# EAGLE design placa (EAGLE 7.6.0)
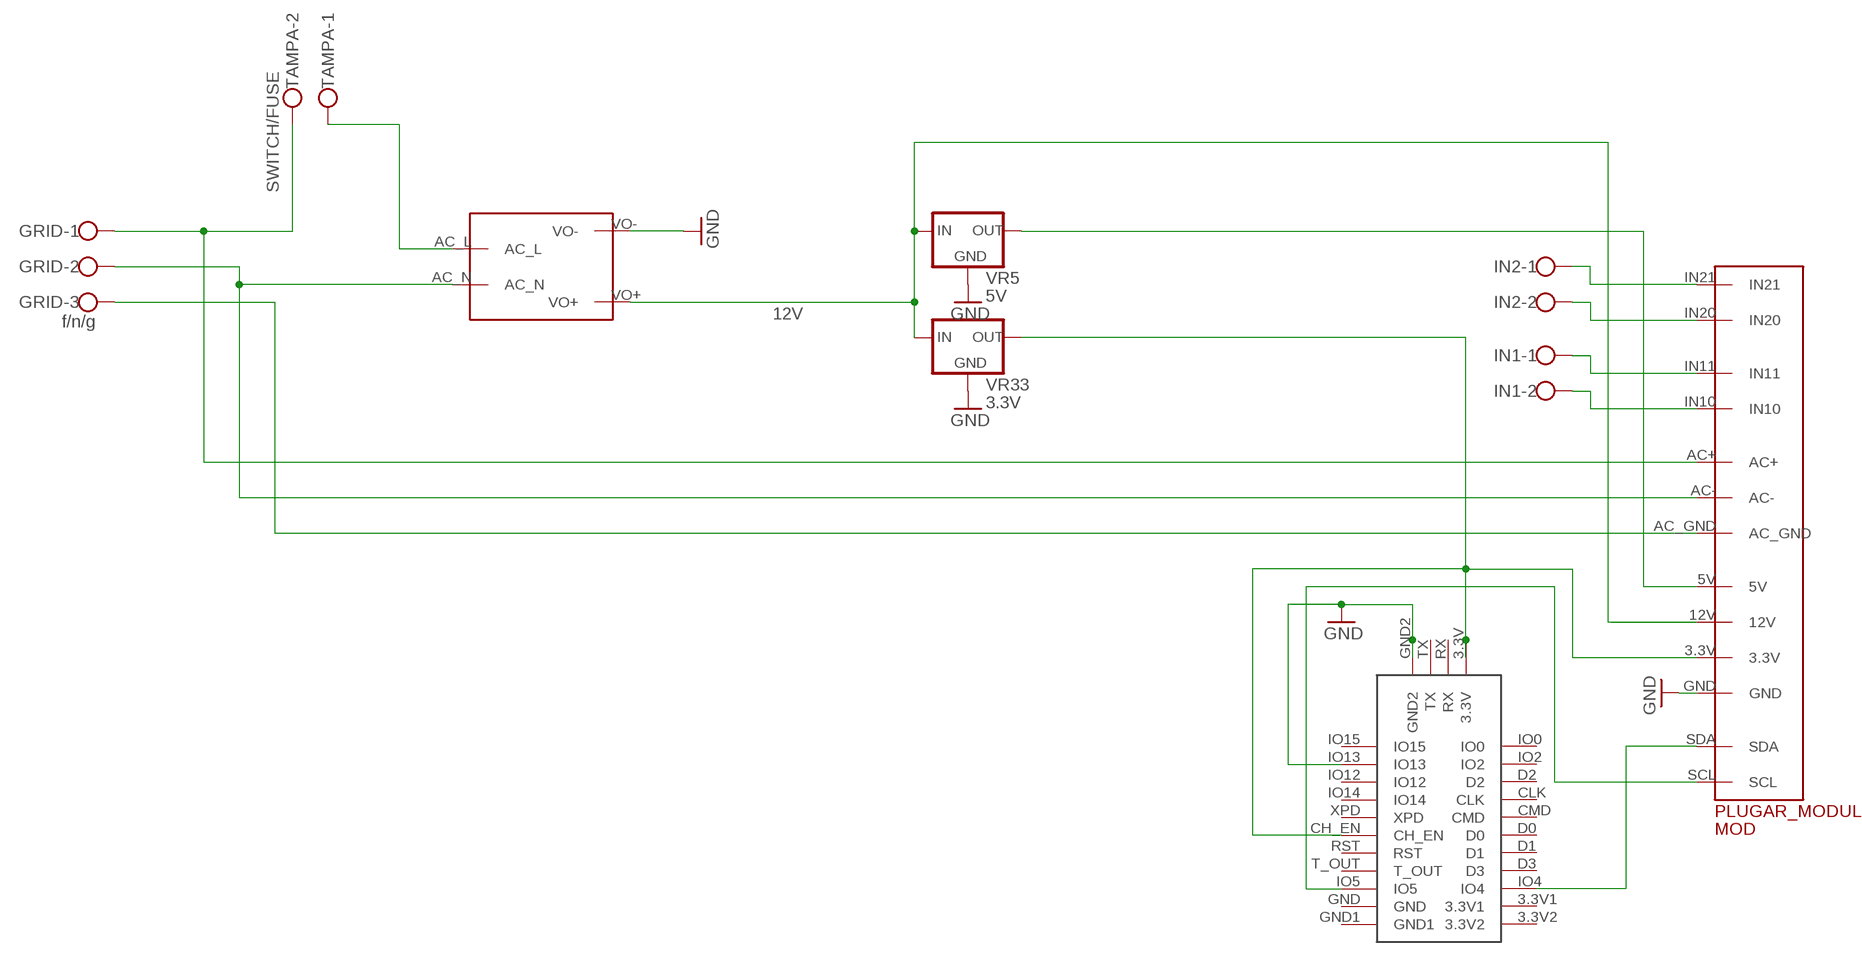
[diagram p0: schematic, sheet 1]

## Parts
GRID  f/n/g  W237-103  [W237-103]
IN1  W237-102  [W237-102]
IN2  W237-102  [W237-102]
MOD  PLUGARPADS  [PLUGAR]
TAMPA  SWITCH/FUSE  W237-102  [W237-102]
U$1  MAINS_CONVERTERS  [HLK-PM01]
U$2  ESP-201  [ESP-201]
VR5  5V  78LXX  [78LXX]
VR33  3.3V  78LXX  [78LXX]

## Nets
3.3V: MOD.3.3V U$2.3.3V U$2.CH_EN VR33.OUT
5V: MOD.5V VR5.OUT
12V: MOD.12V U$1.VO+ VR5.IN VR33.IN
AC+: GRID.1 MOD.AC+ TAMPA.2
AC-: GRID.2 MOD.AC- U$1.AC_N
AC_GND: GRID.3 MOD.AC_GND
GND: MOD.GND U$1.VO- U$2.GND2 U$2.IO13 VR5.GND VR33.GND
N$1: IN2.1 MOD.IN21
N$2: TAMPA.1 U$1.AC_L
N$3: IN2.2 MOD.IN20
N$4: IN1.1 MOD.IN11
N$5: IN1.2 MOD.IN10
SCL: MOD.SCL U$2.IO5
SDA: MOD.SDA U$2.IO4
Unconnected: U$2.3.3V1 U$2.3.3V2 U$2.CLK U$2.CMD U$2.D0 U$2.D1 U$2.D2 U$2.D3 U$2.GND U$2.GND1 U$2.IO0 U$2.IO2 U$2.IO12 U$2.IO14 U$2.IO15 U$2.RST U$2.RX U$2.T_OUT U$2.TX U$2.XPD

## Library data of the parts
GRID = con-wago-500:W237-103: WAGO SCREW CLAMP; MPN: 237-103; OC_FARNELL: unknown; OC_NEWARK: 18M7116
IN1 IN2 TAMPA = con-wago-500:W237-102: WAGO SCREW CLAMP; MPN: 237-102; OC_FARNELL: unknown; OC_NEWARK: 70K9898
MOD = PLUGAR_pads:PLUGARPADS
U$1 = captain-slow:MAINS_CONVERTERS
U$2 = PLUGAR_pads:ESP-201
VR5 VR33 = v-reg:78LXX: VOLTAGE REGULATOR

## Net classes
0 default: width 0.305 mm, drill 0.508 mm, clearance 0.203 mm

## Board
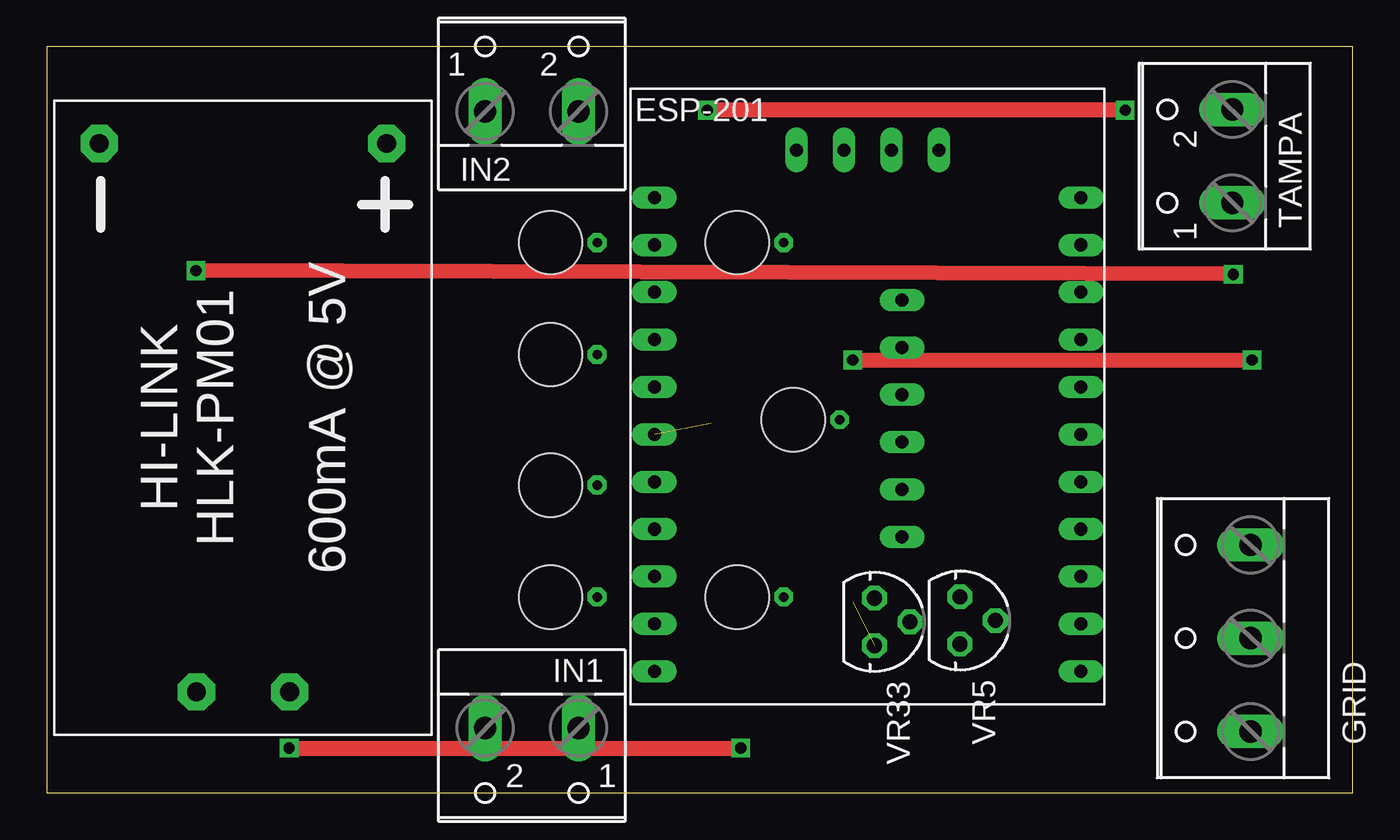
[diagram p1: board, top side]
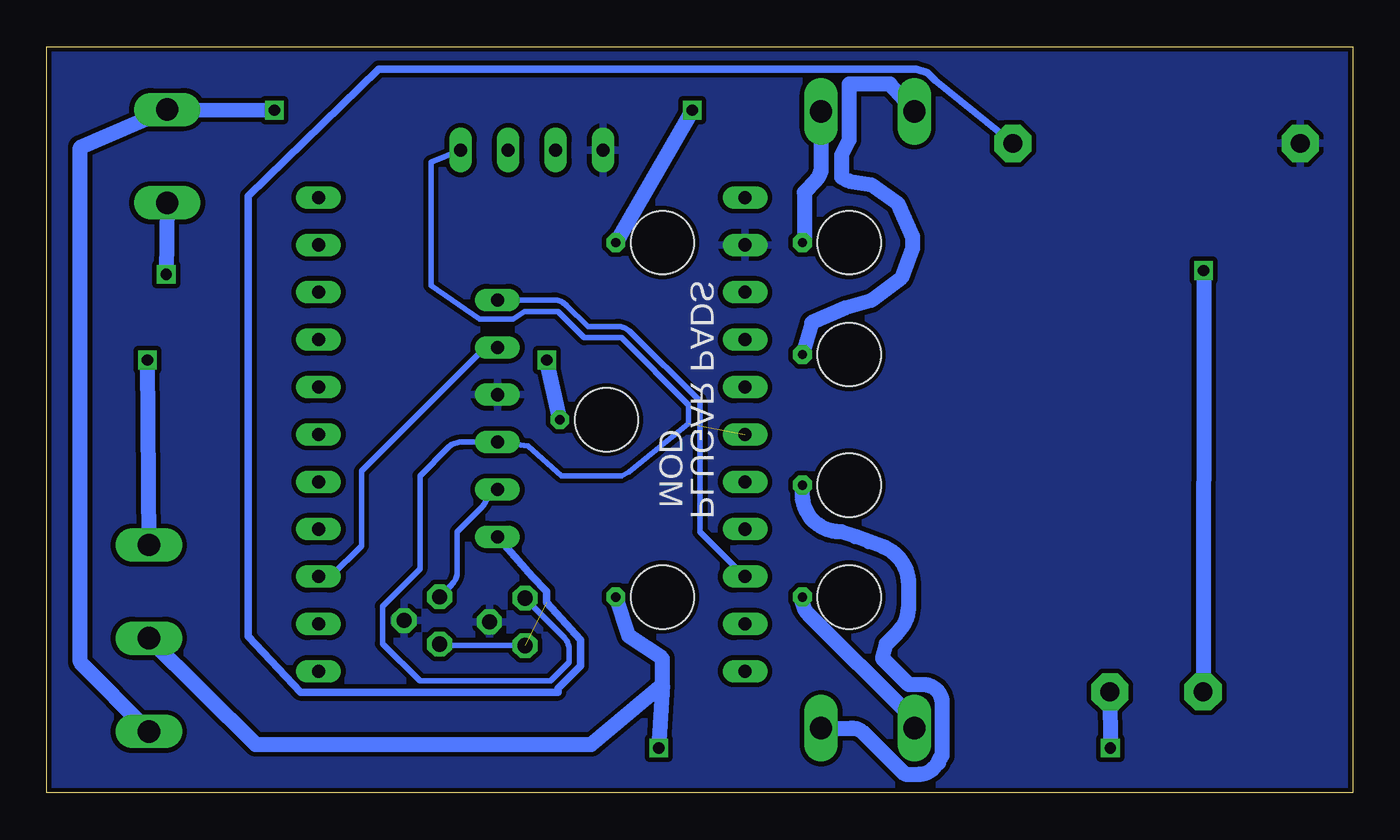
[diagram p2: board, bottom side, seen from below]

Size 70 x 40 mm. Coordinates in mm from the lower left corner, seen from the top.
Outline: 70,0 70,40 0,40 0,0 70,0
Copper layers (1*16): Top 0.035mm / dielectric 1.5mm / Bottom 0.035mm
Design rules "default *": minimum track width 10mil, minimum drill 0.1mm, track to track 0.25mm, track to pad 0.25mm, pad to pad 0.25mm, via to via 0.25mm, smd to smd 0.25mm, copper to edge 0.25mm, drill to drill 0.25mm, minimum pad ring 10mil, minimum via ring 8mil, stop-mask expansion 4mil, vias tented up to drill 0mil, thermal gap 10mil

### Footprints (pad centres in the part's own frame; a part is rotated, then mirrored left to right if it is on the bottom)
W237-103 = drill 1.194 long: 1 -5,-1.29; 2 0,-1.29; 3 5,-1.29
W237-102 = drill 1.194 long: 1 -2.5,-1.27; 2 2.5,-1.27
PLUGAR = drill 0.7 long: 3.3V -1.2,-5.84; 5V -3.74,-5.84; 12V -6.28,-5.84; GND 1.34,-5.84; SCL 6.42,-5.84; SDA 3.88,-5.84 | drill 0.5 pad 0.61 octagon: AC+ 9.5,0.5; AC- -9.5,0.5; AC_GND 0,-2.5; IN10 -9.5,10.5; IN11 -3.5,10.5; IN20 9.5,10.5; IN21 3.5,10.5 | hole 3.4: 0,0; 9.5,3; -9.5,3; -9.5,13; 9.5,13; -3.5,13; 3.5,13
HLK-PM01 = drill 1 pad 2 octagon: AC_L -14.7,2.5; AC_N -14.7,-2.5; VO+ 14.7,-7.7; VO- 14.7,7.7
ESP-201 = drill 0.7 pad 0.813 long: 3.3V 3.81,12.7; 3.3V1 11.43,-12.7; 3.3V2 11.43,-15.24; CH_EN -11.43,-2.54; CLK 11.43,2.54; CMD 11.43,0; D0 11.43,-2.54; D1 11.43,-5.08; D2 11.43,5.08; D3 11.43,-7.62; GND -11.43,-12.7; GND1 -11.43,-15.24; GND2 -3.81,12.7; IO0 11.43,10.16; IO2 11.43,7.62; IO4 11.43,-10.16; IO5 -11.43,-10.16; IO12 -11.43,5.08; IO13 -11.43,7.62; IO14 -11.43,2.54; IO15 -11.43,10.16; RST -11.43,-5.08; RX 1.27,12.7; T_OUT -11.43,-7.62; TX -1.27,12.7; XPD -11.43,0
78LXX = drill 0.813 octagon: GND 0,1.905; IN 1.27,0; OUT -1.27,0

### Placement (x,y rotation side)
GRID  63.23,8.29 90 top
IN1  26,2.2 180 top
IN2  26,37.8 0 top
MOD  40,20 90 top
TAMPA  62.27,34.13 90 top
U$1  10.52,20.11 90 top
U$2  44,21.75 0 top
VR5  48.94,9.24 270 top
VR33  44.36,9.17 270 top

### Tracks (layer width: path | path; a pad name or v marks a point on that pad's centre or on a via)
3.3V  (1 unrouted)
  Bottom 0.305: VR33.OUT 42.29,8.37 arc45 42,7.66 42,7 43,6 50,6 52,8 52,10 50,12 50,17 48.49,18.51 arc45 47.79,18.8 MOD.3.3V 44.2,18.6 42.4,17 39.2,17 38.8,17.2 35.6,19.8 35.6,20.8 39.2,24.4 41.2,24.4 42.6,25.8 44.4,25.8 45,25.4 46.8,25.4 49.4,27.2 49.4,33.8 U$2.3.3V
5V
  Bottom 0.305: MOD.5V 45.88,16.25 46.38,16.25 46.38,16.04 arc45 46.67,15.33 48,14 48,11.87 arc45 48.29,11.16 VR5.OUT
12V  (1 unrouted)
  Bottom 0.305: VR33.IN 48.76,7.9 arc45 VR5.IN
  Bottom 0.406: U$1.VO+ 22.4,38.2 22.8,38.6 23.4,38.8 52.2,38.8 59.2,32 59.2,8.4 56.4,5.4 42.6,5.4 42.6,5.6 41.4,6.8 41.4,8.2 43.2,10.2 43.2,10.8 44,11.6 MOD.12V
AC+  (via drill 0.6)
  Top 0.813: v57.8,36.6 v35.4,36.6
  Bottom 0.813: GRID.1 68.2,7 68.2,34.6 TAMPA.2 v57.8,36.6 | v35.4,36.6 MOD.AC+
AC-  (via drill 0.6)
  Top 0.813: v13,2.4 v37.2,2.4
  Bottom 0.813: GRID.2 58.8,2.6 40.8,2.6 37,5.8 | 37,5.8 37,7.2 38.8,8.4 MOD.AC- | 37,5.8 v37.2,2.4 | U$1.AC_N v13,2.4
AC_GND  (via drill 0.6)
  Top 0.813: v43.2,23.2 v64.6,23.2
  Bottom 0.813: MOD.AC_GND v43.2,23.2 | v64.6,23.2 GRID.3
GND
  pour Bottom: -0.5,40.49 -0.5,-1.01 70.5,-1.01 70.5,40.49
N$1
  Bottom 0.813: MOD.IN21 29,25.2 27.2,26 25.8,26.4 24.2,27.6 23.6,29.2 23.6,29.8 24.4,31.6 25.8,32.6 27,32.8 27.4,33 27.4,34.2 27,35 27,38 24.8,38 IN2.1
N$2  (via drill 0.6)
  Top 0.813: v63.6,27.8 v8,28
  Bottom 0.813: TAMPA.1 v63.6,27.8 | v8,28 U$1.AC_L
N$3
  Bottom 0.813: IN2.2 28.5,33.51 arc45 28.79,32.81 29.4,32.2 29.4,29.74 arc45 MOD.IN20
N$4
  Bottom 0.813: IN1.1 26.88,3.47 arc45 26.18,3.18 24,1 23.21,1 arc-45 22.51,1.29 22.2,1.6 arc45 22.06,1.94 22,2 22,4.8 arc-90 23,5.8 23.8,5.8 25.2,7.2 25,8 24.39,8.61 arc-45 23.8,10.03 23.8,11.2 arc-70 25.2,13.2 arc0 27.4,14 27.5,14 arc90 29.5,16 MOD.IN11
N$5
  Bottom 0.813: MOD.IN10 29.5,10.31 arc-45 29.21,9.61 23.8,4.2 23.8,4.18 arc-45 IN1.2
SCL
  Bottom 0.305: MOD.SCL 42.83,26.42 arc45 42.13,26.13 41,25 39.41,25 arc45 38.71,24.71 35,21 35,14 33,12 arc45 32.95,11.98 U$2.IO5
SDA
  Bottom 0.305: MOD.SDA 45.88,23.88 46.5,23.88 53.12,17.25 53.12,13.25 54.75,11.62 55.38,11.62 U$2.IO4